# Altium schematic sheet MCU.SchDoc
size A3
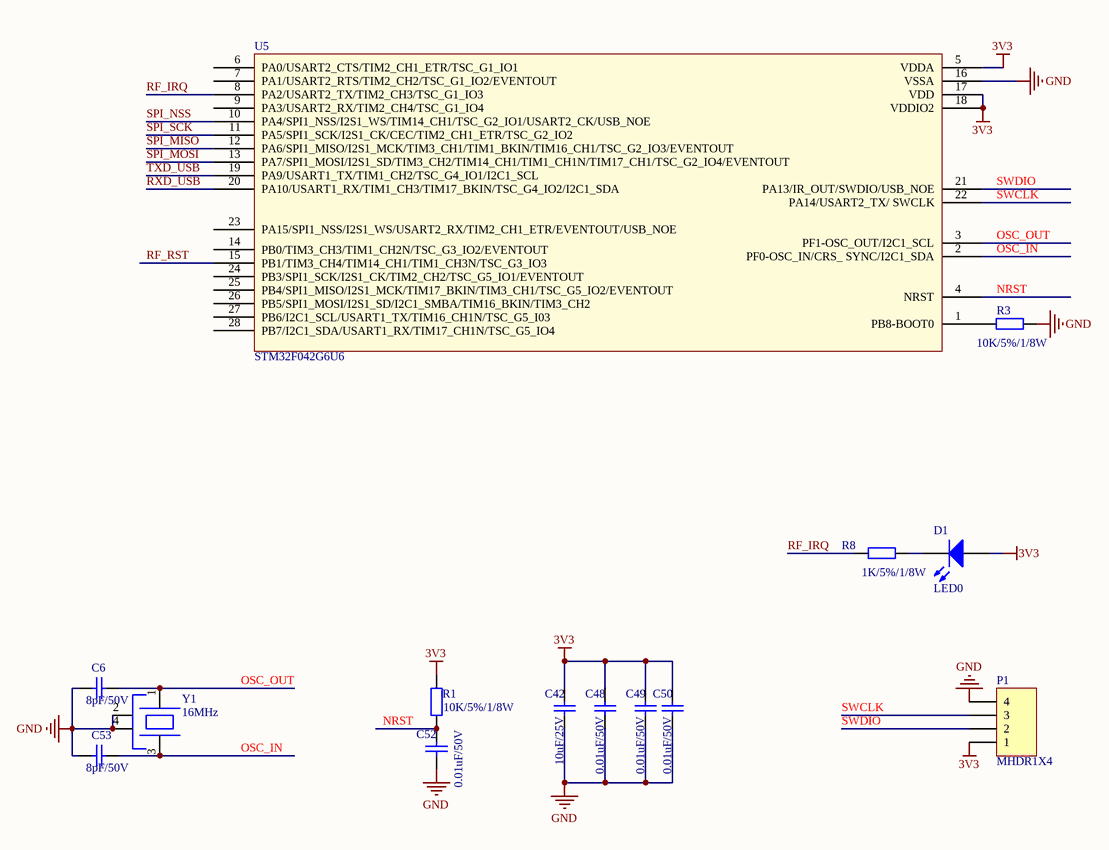
[diagram p0: MCU.SchDoc]

## Parts
C6  8pF/50V  [0402C]
C42  10uF/25V  [0603C]
C48  0.01uF/50V  [0402C]
C49  0.01uF/50V  [0402C]
C50  0.01uF/50V  [0402C]
C52  0.01uF/50V  [0402C]
C53  8pF/50V  [0402C]
D1  LED0  [0603LED]
P1  MHDR1X4  [MHDR1X4]
R1  10K/5%/1/8W  [0402R]
R3  10K/5%/1/8W  [0402R]
R8  1K/5%/1/8W  [0402R]
U5  STM32F042G6U6  [UFQFPN28]
Y1  16MHz  [OSCILLATOR-3.2X2.5]

## Nets
3V3: C42.1 C48.1 C49.1 C50.1 D1.1(A) P1.1 R1.2 U5.5(VDDA) U5.17(VDD) U5.18(VDDIO2)
GND: C6.1 C42.2 C48.2 C49.2 C50.2 C52.2 C53.1 P1.4 R3.1 U5.16(VSSA) Y1.2(GND) Y1.4(GND)
NRST: C52.1 R1.1 U5.4(NRST)
OSC_IN: C53.2 U5.2(PF0-OSC_IN/CRS__SYNC/I2C1_SDA) Y1.3
OSC_OUT: C6.2 U5.3(PF1-OSC_OUT/I2C1_SCL) Y1.1
RF_IRQ: R8.2 U5.8(PA2/USART2_TX/TIM2_CH3/TSC_G1_IO3)
RF_RST: U5.15(PB1/TIM3_CH4/TIM14_CH1/TIM1_CH3N/TSC_G3_IO3)
RXD_USB: U5.20(PA10/USART1_RX/TIM1_CH3/TIM17_BKIN/TSC_G4_IO2/I2C1_SDA)
SPI_MISO: U5.12(PA6/SPI1_MISO/I2S1_MCK/TIM3_CH1/TIM1_BKIN/TIM16_CH1/TSC_G2_IO3/EVENTOUT)
SPI_MOSI: U5.13(PA7/SPI1_MOSI/I2S1_SD/TIM3_CH2/TIM14_CH1/TIM1_CH1N/TIM17_CH1/TSC_G2_IO4/EVENTOUT)
SPI_NSS: U5.10(PA4/SPI1_NSS/I2S1_WS/TIM14_CH1/TSC_G2_IO1/USART2_CK/USB_NOE)
SPI_SCK: U5.11(PA5/SPI1_SCK/I2S1_CK/CEC/TIM2_CH1_ETR/TSC_G2_IO2)
SWCLK: P1.3 U5.22(PA14/USART2_TX/_SWCLK)
SWDIO: P1.2 U5.21(PA13/IR_OUT/SWDIO/USB_NOE)
TXD_USB: U5.19(PA9/USART1_TX/TIM1_CH2/TSC_G4_IO1/I2C1_SCL)
NetD1_2: D1.2(K) R8.1
NetR3_2: R3.2 U5.1(PB8-BOOT0)

Not connected (* = marked no-connect by the designer): U5 6(PA0/USART2_CTS/TIM2_CH1_ETR/TSC_G1_IO1) 7(PA1/USART2_RTS/TIM2_CH2/TSC_G1_IO2/EVENTOUT) 9(PA3/USART2_RX/TIM2_CH4/TSC_G1_IO4) 14(PB0/TIM3_CH3/TIM1_CH2N/TSC_G3_IO2/EVENTOUT) 23(PA15/SPI1_NSS/I2S1_WS/USART2_RX/TIM2_CH1_ETR/EVENTOUT/USB_NOE) 24(PB3/SPI1_SCK/I2S1_CK/TIM2_CH2/TSC_G5_IO1/EVENTOUT) 25(PB4/SPI1_MISO/I2S1_MCK/TIM17_BKIN/TIM3_CH1/TSC_G5_IO2/EVENTOUT) 26(PB5/SPI1_MOSI/I2S1_SD/I2C1_SMBA/TIM16_BKIN/TIM3_CH2) 27(PB6/I2C1_SCL/USART1_TX/TIM16_CH1N/TSC_G5_I03) 28(PB7/I2C1_SDA/USART1_RX/TIM17_CH1N/TSC_G5_IO4)

## Library data of the parts
C6 C53 = Cap: Capacitor; Published: 8-Jun-2000; LatestRevisionDate: 17-Jul-2002; LatestRevisionNote: Re-released for DXP Platform.; PackageReference: RAD-0.3; Publisher: Altium Limited; Value: 8pF/50V
C42 C48-C50 C52 = Cap: Capacitor; Value: 106; Published: 8-Jun-2000; LatestRevisionDate: 17-Jul-2002; LatestRevisionNote: Re-released for DXP Platform.; PackageReference: RAD-0.3; Publisher: Altium Limited
D1 = LED0: Typical INFRARED GaAs LED; Published: 8-Jun-2000; LatestRevisionDate: 08-Jul-2005; LatestRevisionNote: Mech Layer 1 removed.; PackageReference: LED-0; Publisher: Altium Limited
P1 = MHDR1X4: Header, 4-Pin; LatestRevisionDate: 17-Jul-2002; LatestRevisionNote: Re-released for DXP Platform.; Publisher: Altium Limited
R1 R3 = Res2: Resistor; Published: 8-Jun-2000; LatestRevisionDate: 17-Jul-2002; LatestRevisionNote: Re-released for DXP Platform.; PackageReference: AXIAL-0.4; Publisher: Altium Limited; Value: 10K/5%/1/8W
R8 = Res2: Resistor; Value: 1K; Published: 8-Jun-2000; LatestRevisionDate: 17-Jul-2002; LatestRevisionNote: Re-released for DXP Platform.; PackageReference: AXIAL-0.4; Publisher: Altium Limited
Y1 = XTAL3